# EasyEDA Pro project Project.eprj

# Schematic Schematic1
Create Date: 2025-10-31; Page Name: P1; Project Name: Project; Schematic Name: Schematic1; Update Date: 2026-08-16; Company: 嘉立创EDA; Page Size: A4; Version: V1.0
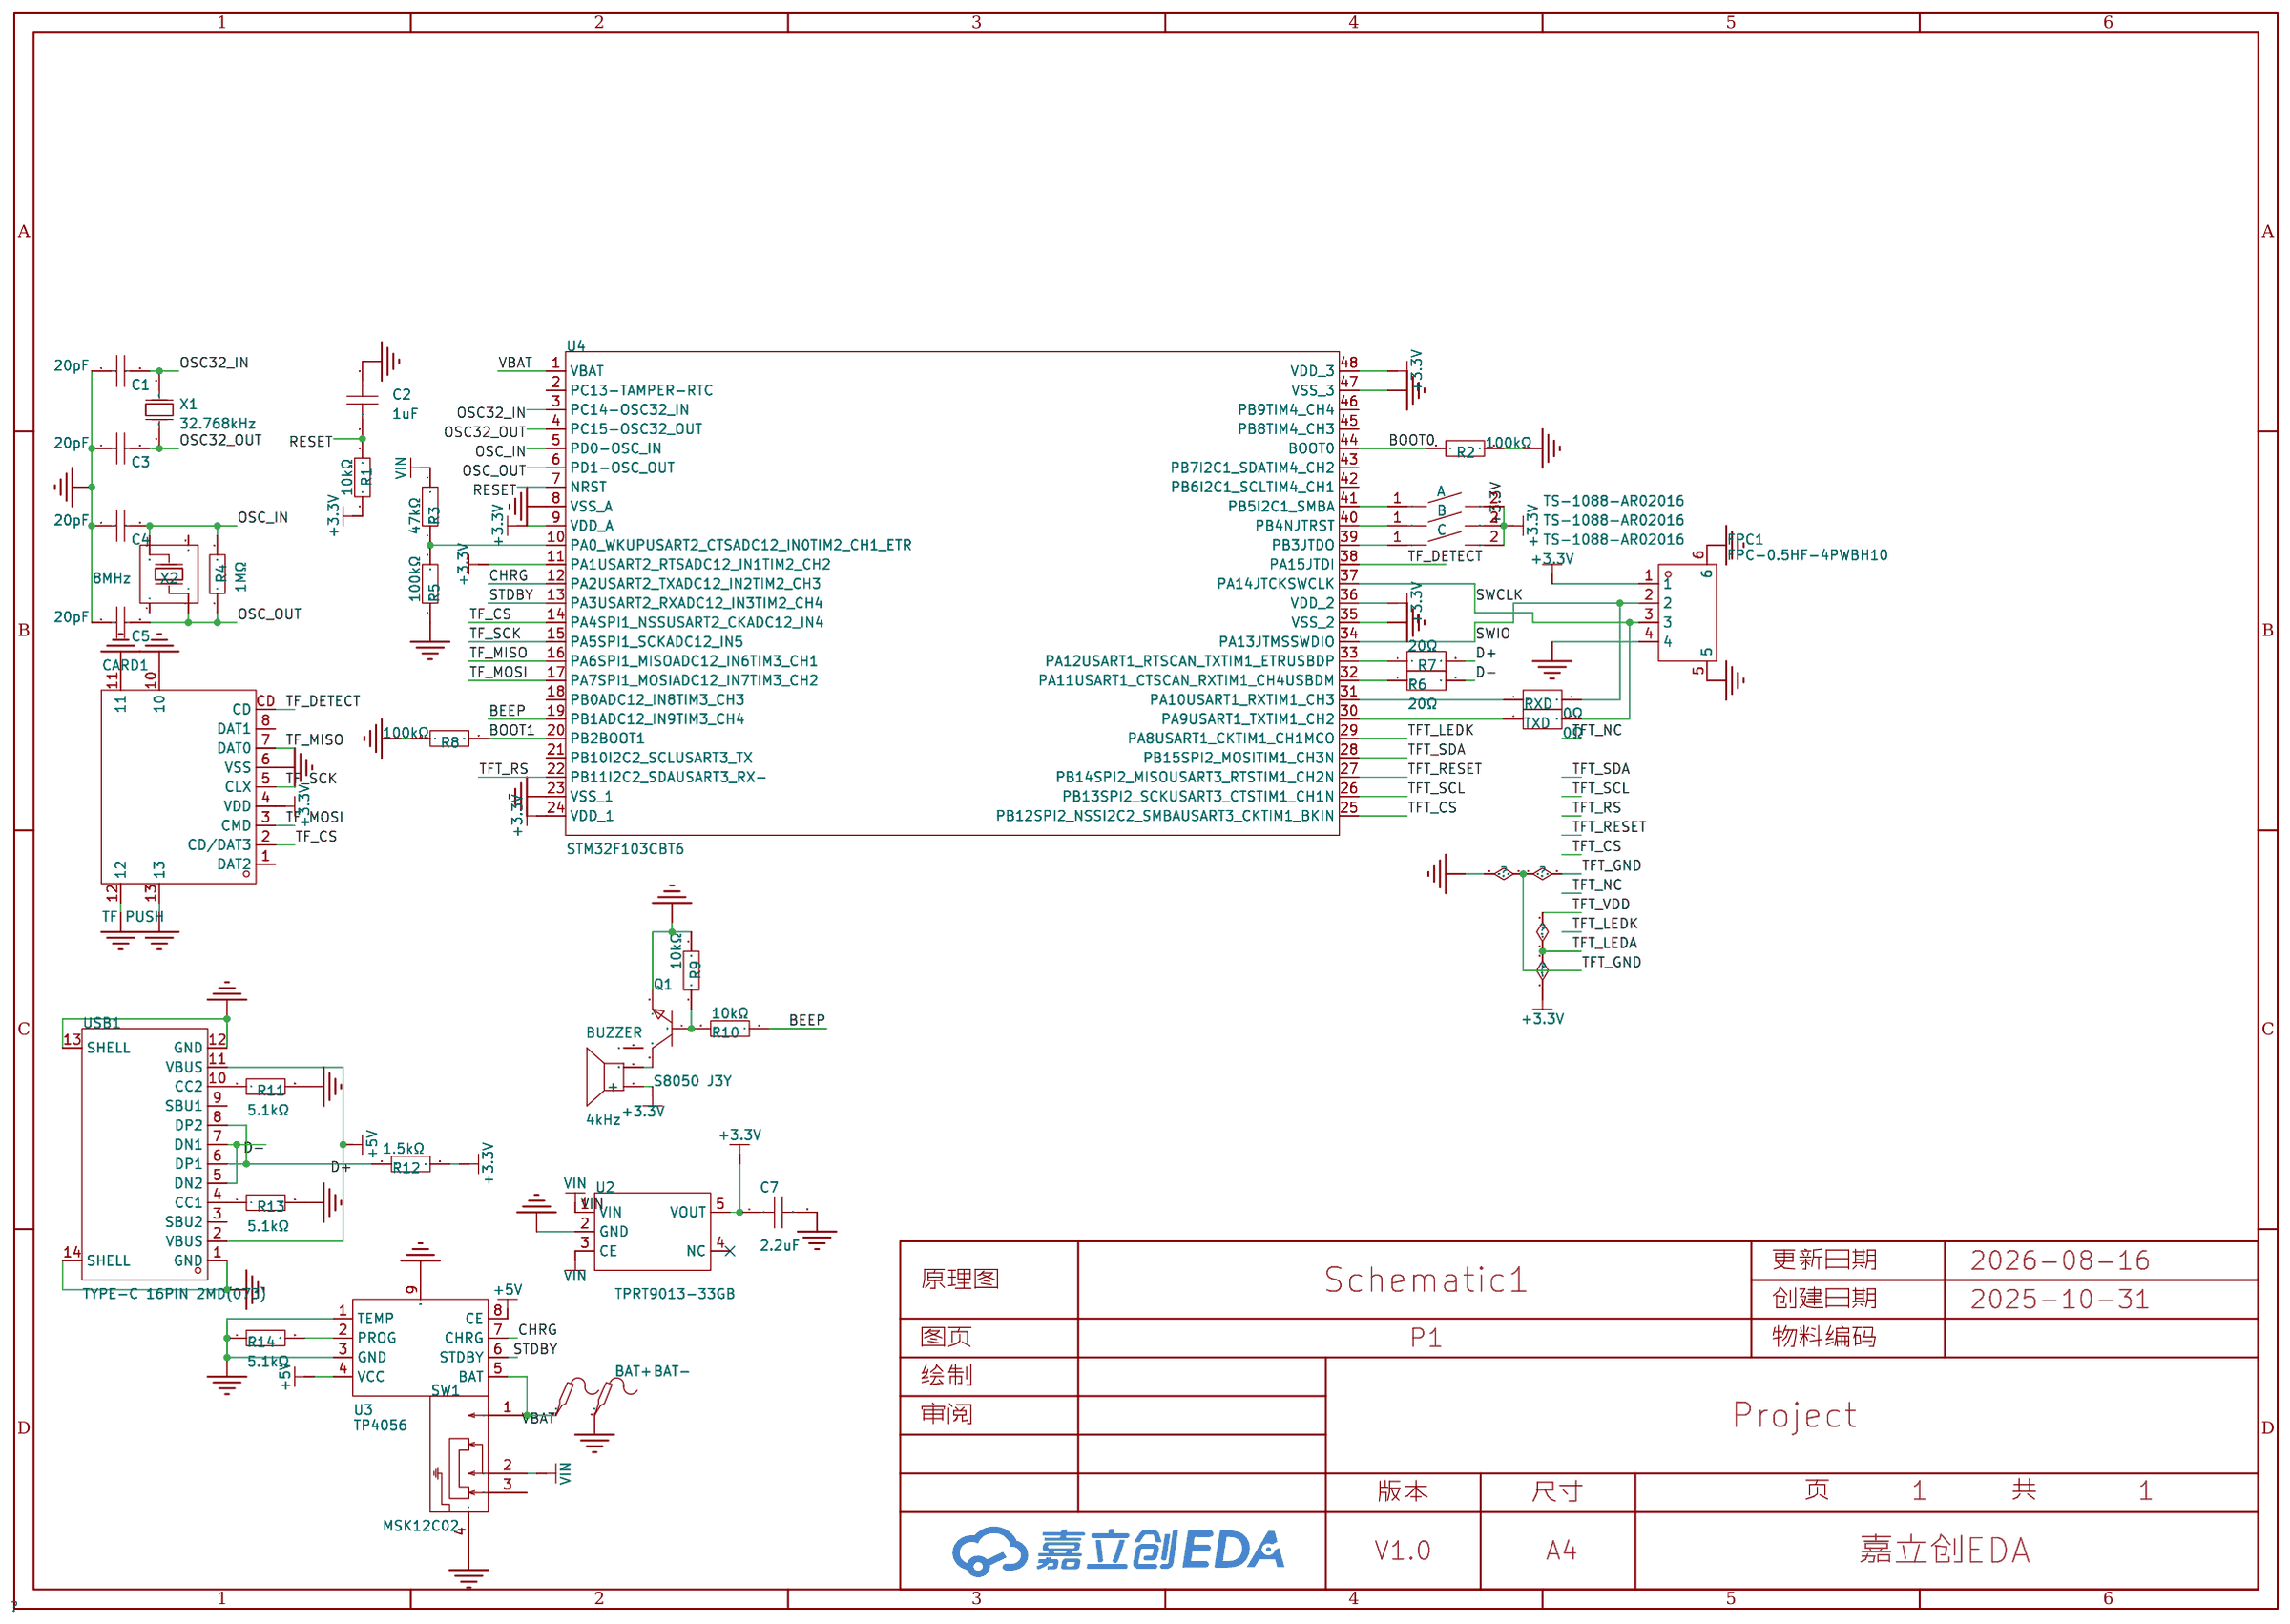
[diagram p0: schematic sheet]

## Parts
A  TS-1088-AR02016  [SW-SMD_L3.9-W3.0-P4.45]
B  TS-1088-AR02016  [SW-SMD_L3.9-W3.0-P4.45]
BAT+  -  [Test-Point-0.5mm]
BAT-  -  [Test-Point-0.5mm]
BUZZER  4kHz  [BUZ-SMD_FST-5020]
C  TS-1088-AR02016  [SW-SMD_L3.9-W3.0-P4.45]
C1  20pF  [C0603]
C2  1uF  [C0603]
C3  20pF  [C0603]
C4  20pF  [C0603]
C5  20pF  [C0603]
C7  2.2uF  [C0603]
CARD1  TF PUSH  [TF-SMD_TF-PUSH]
FPC1  FPC-0.5HF-4PWBH10  [FPC-SMD_4P-P0.50_FPC-0.5HF-4PWBH10]
Q1  S8050 J3Y  [SOT-23-3_L3.0-W1.7-P0.95-LS2.9-BR]
R1  10kΩ  [R0603]
R2  100kΩ  [R0603]
R3  47kΩ  [R0603]
R4  1MΩ  [R0603]
R5  100kΩ  [R0603]
R6  20Ω  [R0603]
R7  20Ω  [R0603]
R8  100kΩ  [R0603]
R9  10kΩ  [R0603]
R10  10kΩ  [R0603]
R11  5.1kΩ  [R0603]
R12  1.5kΩ  [R0603]
R13  5.1kΩ  [R0603]
R14  5.1kΩ  [R0603]
RXD  0Ω  [R0201]
SW1  MSK12C02  [SW-TH_MSK12C02]
TXD  0Ω  [R0201]
U2  TPRT9013-33GB  [SOT-23-5_L3.0-W1.7-P0.95-LS2.8-BL]
U3  TP4056  [ESOP-8_L4.9-W3.9-P1.27-LS6.0-BL-EP-4]
U4  STM32F103CBT6  [LQFP-48_L7.0-W7.0-P0.50-LS9.0-BL]
USB1  TYPE-C 16PIN 2MD(073)  [USB-C-SMD_TYPE-C-6PIN-2MD-073]
X1  32.768kHz  [CRYSTAL-SMD_L3.2-W1.5-1]
X2  8MHz  [CRYSTAL-SMD_4P-L3.2-W2.5-BL]

## Library data of the parts
A B C = TS-1088-AR02016: 电路结构:单刀单掷;按钮形状:圆形按钮;作用力:1.6N;安装方式:立贴;开关长度:4mm;开关宽度:3mm;开关高度:2mm;带支架:不带支架;触点电流:50mA;额定电压:12V;工作寿命:10万次;; LCSC Part Name: 4*3*2mm 立贴 轻触开关; Supplier Part: C720477; Manufacturer: XUNPU(讯普); Supplier Footprint: SMD; JLCPCB Part Class: 基础库; Datasheet: https://item.szlcsc.com/datasheet/TS-1088-AR02016/763484.html; Supplier: LCSC; Circuit: 单刀单掷; Actuator Style: 圆形按钮; Operating Force: 1.6N; Mounting Type: 立贴; Length: 4mm; Width: 3mm; Switch Height: 2mm; with Bracket: 不带支架; Contact Current: 50mA; Voltage Rating: 12V; Actuator/Cap Color: 黑色; Termination Style: SMD接片; Life: 10万次; Operating Temperature: -30℃~+80℃
BAT+ BAT- = Test-Point: Test Point 测试点
BUZZER = FUET-5020: 驱动方式:无源(外部驱动);构造类型:电磁式;频率:4kHz;声压(SPL):75dB;; LCSC Part Name: 电压 3V 频率 4KHZ; Supplier Part: C391029; Manufacturer: FUET(福声科技); Supplier Footprint: SMD,5x5mm; JLCPCB Part Class: 扩展库; Datasheet: https://item.szlcsc.com/datasheet/FUET-5020/367491.html; Supplier: LCSC; Driver Circuitry: 无源(外部驱动); Technology: 电磁式; Voltage - Supply: 2V~4V; Sound Pressure Level(SPL): 75dB; Length: 5mm; Width: 5mm; Height: 2.2mm
C1 C3-C5 = CL10C200JB8NNNC: 容值:20pF;精度:±5%;额定电压:50V;温度系数:C0G;; LCSC Part Name: 20pF ±5% 50V; Supplier Part: C1648; Manufacturer: SAMSUNG(三星); Supplier Footprint: 0603; JLCPCB Part Class: 基础库; Datasheet: https://item.szlcsc.com/datasheet/CL10C200JB8NNNC/2000.html; Supplier: LCSC; Tolerance: ±5%; Voltage Rating: 50V; Temperature Coefficient: C0G
C2 = CL10A105KB8NNNC: 容值:1uF;精度:±10%;额定电压:50V;温度系数:X5R;; LCSC Part Name: 1uF ±10% 50V; Supplier Part: C15849; Manufacturer: SAMSUNG(三星); Supplier Footprint: 0603; JLCPCB Part Class: 基础库; Datasheet: https://item.szlcsc.com/datasheet/CL10A105KB8NNNC/16531.html; Supplier: LCSC; Tolerance: ±10%; Voltage Rating: 50V; Temperature Coefficient: X5R
C7 = HGC0603R5225K500NTHJ: 容值:2.2uF;精度:±10%;额定电压:50V;温度系数:X5R;; LCSC Part Name: 2.2uF ±10% 50V; Supplier Part: C7432769; Manufacturer: Chinocera(华瓷); Supplier Footprint: 0603; JLCPCB Part Class: 扩展库; Datasheet: https://item.szlcsc.com/datasheet/HGC0603R5225K500NTHJ/8438251.html; Supplier: LCSC; Tolerance: ±10%; Voltage Rating: 50V; Temperature Coefficient: X5R
CARD1 = TF PUSH: 卡连接方式:自弹式;卡类型:MicroSD卡(TF卡);连接器类型:卡座;本体最大高度:2mm;工作温度:-25℃~+90℃;; LCSC Part Name: 自弹式 MicroSD卡(TF卡) 卡座; Supplier Part: C393941; Manufacturer: SHOU HAN(首韩); Supplier Footprint: SMD; JLCPCB Part Class: 扩展库; Datasheet: https://item.szlcsc.com/datasheet/TF%2520PUSH/372553.html; Supplier: LCSC; Card Connection Mode: 自弹式; Card Type: MicroSD卡(TF卡); Connector Type: 卡座; Additional Card Detection Pins: 无; Height Above Board: 2mm; Operating Temperature: -25℃~+90℃
FPC1 = FPC-0.5HF-4PWBH10: 锁定特性:翻盖式;触点类型:双侧触点/上下接;触点数量:4P;间距:0.5mm;安装方式:卧贴;工作温度:-25℃~+85℃;; LCSC Part Name: 翻盖式 双侧触点/上下接 P数:4P 间距:0.5mm; Supplier Part: C5343272; Manufacturer: XUNPU(讯普); Supplier Footprint: SMD,P=0.5mm,卧贴; JLCPCB Part Class: 扩展库; Datasheet: https://item.szlcsc.com/datasheet/FPC-0.5HF-4PWBH10/6119918.html; Supplier: LCSC; Locking Feature: 翻盖式; Contact Type: 双侧触点/上下接; Number of Contacts: 4P; Pitch: 0.5mm; Mounting Type: 卧贴; FFC, FCB Thickness: 0.3mm; Height Above Board: 1mm; Contact Material: 铜合金; Contact Plating: 锡; Operating Temperature: -25℃~+85℃; Rated Voltage (Max): 50V; Current Rating (Max): 500mA
Q1 = S8050 J3Y_C2146: 晶体管类型:NPN;集电极电流(Ic):500mA;集射极击穿电压(Vceo):25V;功率(Pd):300mW;直流电流增益(hFE@Ic,Vce):200@50mA,1V;; LCSC Part Name: S8050 J3Y(RANGE:200-350) H档(200-350); Supplier Part: C2146; Manufacturer: CJ(江苏长电/长晶); Supplier Footprint: SOT-23; JLCPCB Part Class: 基础库; Datasheet: https://atta.szlcsc.com/upload/public/pdf/source/20140809/1457707209234.pdf; Supplier: LCSC; Transistor Type: NPN; Collector Current (Ic): 500mA; Collector-Emitter Breakdown Voltage (Vceo): 25V; Power Dissipation (Pd): 300mW; DC Current Gain (hFE@Ic,Vce): 200@50mA,1V; Transition Frequency (fT): 150MHz; Collector Cut-Off Current (Icbo): 100nA; Collector-Emitter Saturation Voltage (VCE(sat)@Ic,Ib): 600mV@500mA,50mA
R1 R9 R10 = 0603WAF1002T5E: 电阻类型:厚膜电阻;阻值:10kΩ;精度:±1%;功率:100mW;工作电压:75V;温度系数:±100ppm/℃;; LCSC Part Name: 厚膜电阻 10kΩ ±1% 100mW; Supplier Part: C25804; Manufacturer: UNI-ROYAL(厚声); Supplier Footprint: 0603; JLCPCB Part Class: 基础库; Datasheet: https://item.szlcsc.com/datasheet/0603WAF1002T5E/26547.html; Supplier: LCSC; Type: 厚膜电阻; Tolerance: ±1%; Power(Watts): 100mW; Voltage-Supply(Max): 75V; Temperature Coefficient: ±100ppm/℃; Operating Temperature: -55℃~+155℃
R2 R5 R8 = 0603WAF1003T5E: 电阻类型:厚膜电阻;阻值:100kΩ;精度:±1%;功率:100mW;工作电压:75V;温度系数:±100ppm/℃;; LCSC Part Name: 100kΩ ±1% 100mW 厚膜电阻; Supplier Part: C25803; Manufacturer: UNI-ROYAL(厚声); Supplier Footprint: 0603; JLCPCB Part Class: 基础库; Datasheet: https://item.szlcsc.com/datasheet/0603WAF1003T5E/26546.html; Supplier: LCSC; Type: 厚膜电阻; Tolerance: ±1%; Power(Watts): 100mW; Voltage-Supply(Max): 75V; Temperature Coefficient: ±100ppm/℃; Operating Temperature: -55℃~+155℃
R3 = 0603WAF4702T5E: 电阻类型:厚膜电阻;阻值:47kΩ;精度:±1%;功率:100mW;工作电压:75V;温度系数:±100ppm/℃;; LCSC Part Name: 47kΩ ±1% 100mW 厚膜电阻; Supplier Part: C25819; Manufacturer: UNI-ROYAL(厚声); Supplier Footprint: 0603; JLCPCB Part Class: 基础库; Datasheet: https://item.szlcsc.com/datasheet/0603WAF4702T5E/26562.html; Supplier: LCSC; Type: 厚膜电阻; Tolerance: ±1%; Power(Watts): 100mW; Voltage-Supply(Max): 75V; Temperature Coefficient: ±100ppm/℃; Operating Temperature: -55℃~+155℃
R4 = 0603WAF1004T5E: 电阻类型:厚膜电阻;阻值:1MΩ;精度:±1%;功率:100mW;最大工作电压:75V;温度系数:±100ppm/℃;; LCSC Part Name: 1MΩ ±1% 100mW 厚膜电阻; Supplier Part: C22935; Manufacturer: UNI-ROYAL(厚声); Supplier Footprint: 0603; JLCPCB Part Class: 基础库; Datasheet: https://atta.szlcsc.com/upload/public/pdf/source/20200306/C422600_1E6D84923E4A46A82E41ADD87F860B5C.pdf; Supplier: LCSC; Type: 厚膜电阻; Tolerance: ±1%; Power(Watts): 100mW; Overload Voltage (Max): 75V; Temperature Coefficient: ±100ppm/℃; Operating Temperature Range: -55℃~+155℃
R6 R7 = FRC0603F20R0TS: 电阻类型:厚膜电阻;阻值:20Ω;精度:±1%;功率:100mW;工作电压:75V;温度系数:±100ppm/℃;; LCSC Part Name: 20Ω ±1% 100mW 厚膜电阻; Supplier Part: C2907012; Manufacturer: FOJAN(富捷); Supplier Footprint: 0603; JLCPCB Part Class: 扩展库; Supplier: LCSC; Type: 厚膜电阻; Tolerance: ±1%; Power(Watts): 100mW; Voltage-Supply(Max): 75V; Temperature Coefficient: ±100ppm/℃; Operating Temperature: -55℃~+155℃
R11 R13 R14 = 0603WAF5101T5E: 电阻类型:厚膜电阻;阻值:5.1kΩ;精度:±1%;功率:100mW;工作电压:75V;温度系数:±100ppm/℃;; LCSC Part Name: 5.1kΩ ±1% 100mW 厚膜电阻; Supplier Part: C23186; Manufacturer: UNI-ROYAL(厚声); Supplier Footprint: 0603; JLCPCB Part Class: 基础库; Datasheet: https://item.szlcsc.com/datasheet/0603WAF5101T5E/23913.html; Supplier: LCSC; Type: 厚膜电阻; Tolerance: ±1%; Power(Watts): 100mW; Voltage-Supply(Max): 75V; Temperature Coefficient: ±100ppm/℃; Operating Temperature: -55℃~+155℃
R12 = 0603WAF1501T5E: 电阻类型:厚膜电阻;阻值:1.5kΩ;精度:±1%;功率:100mW;工作电压:75V;温度系数:±100ppm/℃;; LCSC Part Name: 1.5kΩ ±1% 100mW 厚膜电阻; Supplier Part: C22843; Manufacturer: UNI-ROYAL(厚声); Supplier Footprint: 0603; JLCPCB Part Class: 基础库; Datasheet: https://item.szlcsc.com/datasheet/0603WAF1501T5E/23570.html; Supplier: LCSC; Type: 厚膜电阻; Tolerance: ±1%; Power(Watts): 100mW; Voltage-Supply(Max): 75V; Temperature Coefficient: ±100ppm/℃; Operating Temperature: -55℃~+155℃
RXD TXD = 0201WMF0000TEE: 电阻类型:厚膜电阻;阻值:0Ω;精度:±1%;功率:50mW;工作电压:25V;温度系数:-;; LCSC Part Name: 0Ω ±1% 50mW 厚膜电阻; Supplier Part: C473473; Manufacturer: UNI-ROYAL(厚声); Supplier Footprint: 0201; JLCPCB Part Class: 扩展库; Datasheet: https://item.szlcsc.com/datasheet/0201WMF0000TEE/479866.html; Supplier: LCSC; Type: 厚膜电阻; Tolerance: ±1%; Power(Watts): 50mW; Voltage-Supply(Max): 25V; Operating Temperature: -55℃~+155℃
SW1 = MSK12C02: 电路结构:单刀双掷;安装方式:卧贴;开关颜色:-;额定电流:50mA;额定电压:12V;工作寿命:1万次;; LCSC Part Name: 两档侧拨贴片 7脚 滑动开关; Supplier Part: C431540; Manufacturer: SHOU HAN(首韩); Supplier Footprint: SMD,8x2.8mm; JLCPCB Part Class: 扩展库; Datasheet: https://item.szlcsc.com/datasheet/MSK12C02/427897.html; Supplier: LCSC; Circuit: 单刀双掷; Termination Style: SMD接片; Length: 8mm; Width: 2.8mm; Switch Height: 1.4mm; Mounting Type: 卧贴; Current Rating: 50mA; Voltage Rating: 12V; Life: 1万次; Operating Temperature: -20℃~+70℃
U2 = TPRT9013-33GB: 输出类型:固定;工作电压:7V;输出电压:3.3V;输出电流:500mA;电源纹波抑制比(PSRR):70dB@(1kHz);输出极性:正极;; Supplier Part: C587158; Manufacturer: TECH PUBLIC(台舟); Supplier Footprint: SOT-23-5; JLCPCB Part Class: 扩展库; Datasheet: https://atta.szlcsc.com/upload/public/pdf/source/20210810/692D4D0C3CF190F9330EFD28C3E572CB.pdf; Supplier: LCSC; Output Type: 固定; Voltage - Supply: 7V; Output Voltage: 3.3V; Output Current: 500mA; Power Supply Rejection Ratio (PSRR): 70dB@(1kHz); Operating Temperature: -40℃~+85℃@(Ta); Output Configuration: 正极; Number of Outputs: 1
U3 = TP4056_C20199357: 工作电压:-300mV~8V;最大充电电流:1A;电池类型:锂离子/聚合物;电池节数:1;; LCSC Part Name: 线性锂电池充电芯片; Supplier Part: C20199357; Manufacturer: YONGYUTAI(永裕泰); Supplier Footprint: ESOP-8; JLCPCB Part Class: 扩展库; Datasheet: https://item.szlcsc.com/datasheet/TP4056/21524593.html; Supplier: LCSC; The Chip Type: 充电芯片; Voltage - Supply: -300mV~8V; Charge Current - Max: 1A; Charging Saturation Voltage: 4.2V; Type of Battery: 锂离子/聚合物; Number of Cells: 1; Operating Temperature: -40℃~+85℃; Battery Temperature Detection: 支持; Supply Current (Iq): 100uA
U4 = STM32F103CBT6: CPU内核:ARM Cortex-M3;CPU最大主频:72MHz;CPU位数:32 Bit;; LCSC Part Name: 主流增强型ARM Cortex-M3 MCU，具有128 KB Flash、72 MHz CPU、电机控制、USB和CAN; Supplier Part: C8304; Manufacturer: ST(意法半导体); Supplier Footprint: LQFP-48(7x7); JLCPCB Part Class: 扩展库; Datasheet: https://item.szlcsc.com/datasheet/STM32F103CBT6/8796.html; Supplier: LCSC; CPU Core: ARM Cortex-M3; CPU Maximum Speed: 72MHz; Core Size: 32 Bit; Program Storage Size: 128KB; Program Memory Type: FLASH; RAM Size: 20KB; Number of I/O: 37; ADC (Bit): 12bit; Oscillator Type: 内置; Voltage - Supply: 2V~3.6V; Operating Temperature: -40℃~+85℃
USB1 = TYPE-C 16PIN 2MD(073): 连接器类型:Type-C;协议标准:USB 3.1;公母:母;安装方式:卧贴;触点数量:16P;端口数量:1;额定电流 - 电源:3A;工作温度:-25℃~+85℃;; LCSC Part Name: Type-C 母 卧贴; Supplier Part: C2765186; Manufacturer: SHOU HAN(首韩); Supplier Footprint: SMD; JLCPCB Part Class: 扩展库; Datasheet: https://atta.szlcsc.com/upload/public/pdf/source/20250506/FFB74EDFDFA0AC372CE4A8E4F739CCEF.pdf; Supplier: LCSC; Connector Type: Type-C; Protocol Standard: USB 3.1; Gender: 母; Mounting Type: 卧贴; Number of Contacts: 16P; Number of Ports: 1; Current Rating-Power: 3A; Voltage Rating: 5V; Connect-Disconnect Life: 5千次; Detection color: 黑色; Operating Temperature: -25℃~+85℃
X1 = XKXGI-SUA-32.768K: 晶振类型:贴片晶振;频率:32.768kHz;常温频差:±20ppm;负载电容:12.5pF;频率稳定度:±30ppm;; LCSC Part Name: YST310S 32.768KHZ 2P 3215 12.5PF ±20PPM -40~85℃; Supplier Part: C5213671; Manufacturer: YXC(扬兴晶振); Supplier Footprint: SMD3215-2P; JLCPCB Part Class: 扩展库; Datasheet: https://item.szlcsc.com/datasheet/XKXGI-SUA-32.768K/5908943.html; Supplier: LCSC; Type: 贴片晶振; Normal temperature Frequency Tolerance: ±20ppm; Load Capacitance: 12.5pF; Frequency Stability: ±30ppm; Operating Temperature: -40℃~+85℃
X2 = TAXM8M4RDBCCT2T: 晶振类型:贴片晶振;频率:8MHz;常温频差:±10ppm;负载电容:10pF;频率稳定度:±15ppm;; LCSC Part Name: 8MHz ±10ppm 10pF; Supplier Part: C400090; Manufacturer: YJX(雅晶鑫); Supplier Footprint: SMD3225-4P; JLCPCB Part Class: 扩展库; Datasheet: https://item.szlcsc.com/datasheet/TAXM8M4RDBCCT2T/383475.html; Supplier: LCSC; Type: 贴片晶振; Normal temperature Frequency Tolerance: ±10ppm; Load Capacitance: 10pF; Frequency Stability: ±15ppm; Equivalent Series Resistance(ESR): 250Ω; Operating Temperature: -40℃~+85℃

## Nets
+3.3V: A.2 B.2 BUZZER.1(+) C.2 C7.1 CARD1.4(VDD) FPC1.1 R1.1 R12.2 U2.5(VOUT) U4.9(VDD_A) U4.11(PA1USART2_RTSADC12_IN1TIM2_CH2) U4.24(VDD_1) U4.36(VDD_2) U4.48(VDD_3)
+5V: U3.4(VCC) U3.8(CE) USB1.2(VBUS) USB1.11(VBUS)
GND: BAT-.1 C1.1 C2.2 C3.1 C4.1 C5.1 C7.2 CARD1.6(VSS) CARD1.10 CARD1.11 CARD1.12 CARD1.13 FPC1.4 FPC1.5 FPC1.6 Q1.2(E) R2.2 R5.1 R8.1 R9.2 R11.2 R13.2 R14.1 SW1.4 U2.2(GND) U3.1(TEMP) U3.3(GND) U3.9(PAD) U4.8(VSS_A) U4.23(VSS_1) U4.35(VSS_2) U4.47(VSS_3) USB1.1(GND) USB1.12(GND) USB1.13(SHELL) USB1.14(SHELL)
VBAT: BAT+.1 SW1.1 U3.5(BAT) U4.1(VBAT)
VIN: R3.2 SW1.2 U2.1(VIN) U2.3(CE)
BEEP: R10.1 U4.19(PB1ADC12_IN9TIM3_CH4)
BOOT0: R2.1 U4.44(BOOT0)
BOOT1: R8.2 U4.20(PB2BOOT1)
CHRG: U3.7(CHRG) U4.12(PA2USART2_TXADC12_IN2TIM2_CH3)
D+: R7.2 R12.1 USB1.6(DP1) USB1.8(DP2)
D-: R6.2 USB1.5(DN2) USB1.7(DN1)
OSC32_IN: C1.2 U4.3(PC14-OSC32_IN) X1.2(OSC2)
OSC32_OUT: C3.2 U4.4(PC15-OSC32_OUT) X1.1(OSC1)
OSC_IN: C4.2 R4.2 U4.5(PD0-OSC_IN) X2.3
OSC_OUT: C5.2 R4.1 U4.6(PD1-OSC_OUT) X2.1
RESET: C2.1 R1.2 U4.7(NRST)
STDBY: U3.6(STDBY) U4.13(PA3USART2_RXADC12_IN3TIM2_CH4)
SWCLK: FPC1.3 TXD.2 U4.37(PA14JTCKSWCLK)
SWIO: FPC1.2 RXD.2 U4.34(PA13JTMSSWDIO)
TF_CS: CARD1.2(CD/DAT3) U4.14(PA4SPI1_NSSUSART2_CKADC12_IN4)
TF_DETECT: CARD1.CD U4.38(PA15JTDI)
TF_MISO: CARD1.7(DAT0) U4.16(PA6SPI1_MISOADC12_IN6TIM3_CH1)
TF_MOSI: CARD1.3(CMD) U4.17(PA7SPI1_MOSIADC12_IN7TIM3_CH2)
TF_SCK: CARD1.5(CLX) U4.15(PA5SPI1_SCKADC12_IN5)
TFT_CS: U4.25(PB12SPI2_NSSI2C2_SMBAUSART3_CKTIM1_BKIN)
TFT_LEDK: U4.29(PA8USART1_CKTIM1_CH1MCO)
TFT_RESET: U4.27(PB14SPI2_MISOUSART3_RTSTIM1_CH2N)
TFT_RS: U4.22(PB11I2C2_SDAUSART3_RX-)
TFT_SCL: U4.26(PB13SPI2_SCKUSART3_CTSTIM1_CH1N)
TFT_SDA: U4.28(PB15SPI2_MOSITIM1_CH3N)
$1N4001: R6.1 U4.32(PA11USART1_CTSCAN_RXTIM1_CH4USBDM)
$1N4003: R7.1 U4.33(PA12USART1_RTSCAN_TXTIM1_ETRUSBDP)
$1N4077: B.1 U4.40(PB4NJTRST)
$1N4610: Q1.1(B) R9.1 R10.2
$1N4932: BUZZER.2 Q1.3(C)
$1N5544: R14.2 U3.2(PROG)
$1N12139: A.1 U4.41(PB5I2C1_SMBA)
$1N18546: R3.1 R5.2 U4.10(PA0_WKUPUSART2_CTSADC12_IN0TIM2_CH1_ETR)
$1N29071: R13.1 USB1.4(CC1)
$1N29073: R11.1 USB1.10(CC2)
$1N30783: TXD.1 U4.30(PA9USART1_TXTIM1_CH2)
$1N30829: RXD.1 U4.31(PA10USART1_RXTIM1_CH3)
$1N32801: C.1 U4.39(PB3JTDO)

Not connected (* = marked no-connect by the designer): BUZZER 3; CARD1 1(DAT2) 8(DAT1); SW1 3; U2 4(NC)*; U4 2(PC13-TAMPER-RTC) 18(PB0ADC12_IN8TIM3_CH3) 21(PB10I2C2_SCLUSART3_TX) 42(PB6I2C1_SCLTIM4_CH1) 43(PB7I2C1_SDATIM4_CH2) 45(PB8TIM4_CH3) 46(PB9TIM4_CH4); USB1 3(SBU2) 9(SBU1); X2 2 4

# Board PCB1
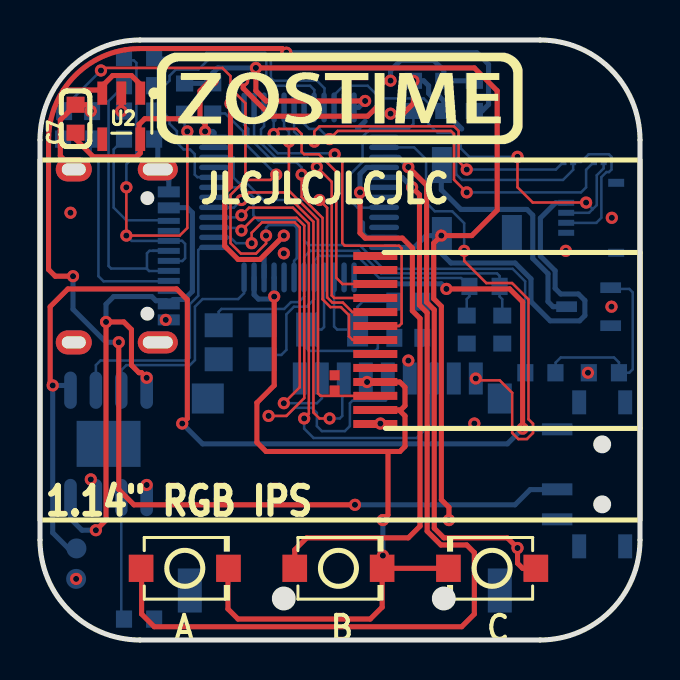
[diagram p1: board, top side]
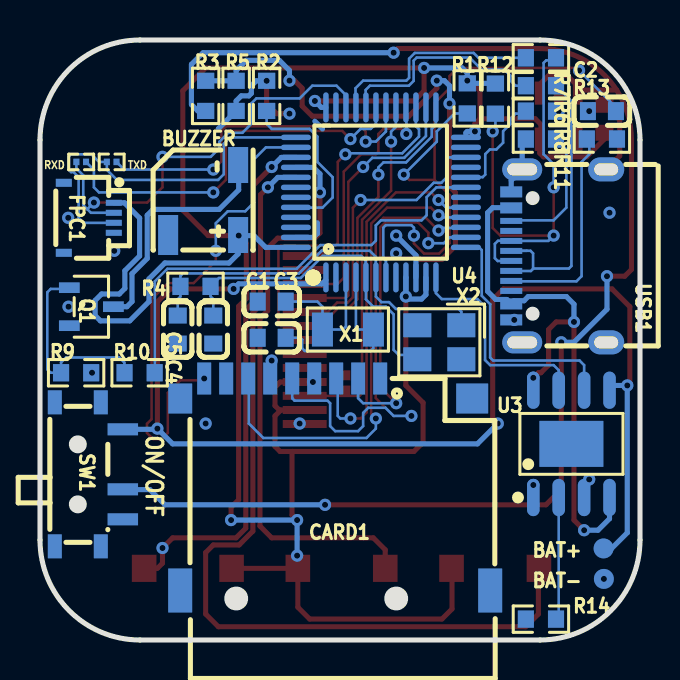
[diagram p2: board, bottom side, seen from below]

Outline 30 x 30 mm; copper layers: Top Layer, Bottom Layer. Coordinates in mm from the lower left corner of the outline.
Outline path: 0,25 0,5 arc(1.46,1.46) 5,0 25,0 arc(28.54,1.46) 30,5 30,25 arc(28.54,28.54) 25,30 5,30 arc(1.46,28.54) 0,25
Stack: Top Layer 0.035mm / Dielectric1 1.51mm FR4 er 4.5 / Bottom Layer 0.035mm

## Design rules (mm)
template: JLCPCB Capability(Two Layers Board)
spacing copperThickness1oz (default): track to track 0.102, other pairs 0.152 to 0.3
spacing copperThickness2oz: track to track 0.203, other pairs 0.152 to 0.3
track width copperThickness1oz (default): min 0.127, default 0.254, max 2.54
track width copperThickness2oz: min 0.203, default 0.254, max 2.54
differential pair differentialPair (default): width min 0.127, default 0.254, max 2.54; gap min 0.152, default 0.152
via viaSize (default): diameter min 0.5, default 0.61, max 10; hole min 0.3, default 0.305, max 6.3

## Placement (name value [footprint] x y rotation side)
A  TS-1088-AR02016  [SW-SMD_L3.9-W3.0-P4.45]  7.24 3.58 0 top
B  TS-1088-AR02016  [SW-SMD_L3.9-W3.0-P4.45]  14.92 3.58 0 top
BAT+  -  [test-point-0.5mm]  1.82 4.58 180 bottom
BAT-  -  [test-point-0.5mm]  1.81 3.06 180 bottom
BUZZER  4kHz  [BUZ-SMD_FST-5020]  21.84 22 90 bottom
C  TS-1088-AR02016  [SW-SMD_L3.9-W3.0-P4.45]  22.61 3.58 180 top
C1  20pF  [C0603]  18.42 16.92 180 bottom
C2  1uF  [C0603]  1.91 26.44 0 bottom
C3  20pF  [C0603]  18.42 15.11 180 bottom
C4  20pF  [C0603]  21.34 15.52 90 bottom
C5  20pF  [C0603]  23.11 15.52 90 bottom
C7  2.2uF  [C0603]  1.78 26.06 90 top
CARD1  TF PUSH  [TF-SMD_TF-PUSH]  15.24 7.78 180 bottom
FPC1  FPC-0.5HF-4PWBH10  [FPC-SMD_4P-P0.50_FPC-0.5HF-4PWBH10]  27.56 21.11 270 bottom
NOREF  -  [Pad_e47]  16.76 11.5 0 top
NOREF#2  -  [Pad_e33]  16.76 17.1 0 top
NOREF#3  -  [Pad_e37]  16.76 16.4 0 top
NOREF#4  -  [Pad_e36]  16.76 15.7 0 top
NOREF#5  -  [Pad_e35]  16.76 15 0 top
NOREF#6  -  [Pad_e1257]  14.73 13.24 0 top
NOREF#7  -  [Pad_e1256]  14.73 12.47 0 top
NOREF#8  -  [Pad_e34]  16.76 14.3 0 top
NOREF#9  -  [Pad_e29]  16.76 19.2 0 top
NOREF#10  -  [Pad_e31]  16.76 18.5 0 top
NOREF#11  -  [Pad_e44]  16.76 13.6 0 top
NOREF#12  -  [Pad_e32]  16.76 17.8 0 top
NOREF#13  -  [Pad_e48]  16.76 10.8 0 top
NOREF#14  -  [Pad_e46]  16.76 12.21 0 top
NOREF#15  -  [Pad_e45]  16.76 12.9 0 top
Q1  S8050 J3Y  [SOT-23-3_L3.0-W1.7-P0.95-LS2.9-BR]  27.43 16.67 0 bottom
R1  10kΩ  [R0603]  8.64 27.08 270 bottom
R2  100kΩ  [R0603]  18.67 27.21 90 bottom
R3  47kΩ  [R0603]  21.72 27.21 270 bottom
R4  1MΩ  [R0603]  22.22 17.68 180 bottom
R5  100kΩ  [R0603]  20.19 27.21 90 bottom
R6  20Ω  [R0603]  4.95 27.71 180 bottom
R7  20Ω  [R0603]  4.95 29.11 180 bottom
R8  100kΩ  [R0603]  4.95 26.44 0 bottom
R9  10kΩ  [R0603]  28.19 13.36 180 bottom
R10  10kΩ  [R0603]  25.02 13.36 0 bottom
R11  5.1kΩ  [R0603]  4.95 25.05 0 bottom
R12  1.5kΩ  [R0603]  7.23 27.07 90 bottom
R13  5.1kΩ  [R0603]  1.91 25.05 180 bottom
R14  5.1kΩ  [R0603]  4.95 1.04 180 bottom
RXD  0Ω  [R0201]  27.94 23.9 0 bottom
SW1  MSK12C02  [SW-TH_MSK12C02]  27.56 8.28 270 bottom
TXD  0Ω  [R0201]  26.42 23.9 0 bottom
U2  TPRT9013-33GB  [SOT-23-5_L3.0-W1.7-P0.95-LS2.8-BL]  4.06 26.19 180 top
U3  TP4056  [ESOP-8_L4.9-W3.9-P1.27-LS6.0-BL-EP-4]  3.43 9.81 180 bottom
U4  STM32F103CBT6  [LQFP-48_L7.0-W7.0-P0.50-LS9.0-BL]  12.95 22.38 180 bottom
USB1  TYPE-C 16PIN 2MD(073)  [USB-C-SMD_TYPE-C-6PIN-2MD-073]  4.06 19.2 90 bottom
X1  32.768kHz  [CRYSTAL-SMD_L3.2-W1.5-1]  14.61 15.52 0 bottom
X2  8MHz  [CRYSTAL-SMD_4P-L3.2-W2.5-BL]  10.03 14.89 0 bottom

## Footprints (pads in the part's own frame, mm; a bottom-side part is the same pattern mirrored in y, then rotated)
BUZ-SMD_FST-5020
  rect 1.8x1 smd: 1(-1.75,-1.75) 2(1.75,-1.75)
  rect 2x1 smd: 3(-1.75,1.75)
C0603
  rect 0.8x0.9 smd: 1(-0.7,0) 2(0.7,0)
CRYSTAL-SMD_4P-L3.2-W2.5-BL
  rect 1.4x1.2 smd: 1(-1.1,-0.85) 2(1.1,-0.85) 3(1.1,0.85) 4(-1.1,0.85)
CRYSTAL-SMD_L3.2-W1.5-1
  rect 1.05x1.7 smd: 1(-1.275,0) 2(1.275,0)
ESOP-8_L4.9-W3.9-P1.27-LS6.0-BL-EP-4
  oval 0.63x1.865 smd: 1(-1.905,-2.683) 2(-0.635,-2.683) 3(0.635,-2.683) 4(1.905,-2.683) 5(1.905,2.683) 6(0.635,2.683) 7(-0.635,2.683) 8(-1.905,2.683)
  rect 3.2x2.3 smd: 9(0,0)
FPC-SMD_4P-P0.50_FPC-0.5HF-4PWBH10
  rect 0.3x0.8 smd: 1(-0.75,1.25) 2(-0.25,1.25) 3(0.25,1.25) 4(0.75,1.25)
  rect 0.4x0.8 smd: 5(1.75,-1.25) 6(-1.75,-1.25)
LQFP-48_L7.0-W7.0-P0.50-LS9.0-BL
  oval 0.27x1.5 smd: 1(-2.75,-4.25) 2(-2.25,-4.25) 3(-1.75,-4.25) 4(-1.25,-4.25) 5(-0.75,-4.25) 6(-0.25,-4.25) 7(0.25,-4.25) 8(0.75,-4.25) 9(1.25,-4.25) 10(1.75,-4.25) 11(2.25,-4.25) 12(2.75,-4.25) 25(2.75,4.25) 26(2.25,4.25) 27(1.75,4.25) 28(1.25,4.25) 29(0.75,4.25) 30(0.25,4.25) 31(-0.25,4.25) 32(-0.75,4.25) 33(-1.25,4.25) 34(-1.75,4.25) 35(-2.25,4.25) 36(-2.75,4.25)
  oval 1.5x0.27 smd: 13(4.25,-2.75) 14(4.25,-2.25) 15(4.25,-1.75) 16(4.25,-1.25) 17(4.25,-0.75) 18(4.25,-0.25) 19(4.25,0.25) 20(4.25,0.75) 21(4.25,1.25) 22(4.25,1.75) 23(4.25,2.25) 24(4.25,2.75) 37(-4.25,2.75) 38(-4.25,2.25) 39(-4.25,1.75) 40(-4.25,1.25) 41(-4.25,0.75) 42(-4.25,0.25) 43(-4.25,-0.25) 44(-4.25,-0.75) 45(-4.25,-1.25) 46(-4.25,-1.75) 47(-4.25,-2.25) 48(-4.25,-2.75)
Pad_e29
  rect 2.2x0.4 smd: 1(0,0)
Pad_e31
  rect 2.2x0.4 smd: 2(0,0)
Pad_e32
  rect 2.2x0.4 smd: 3(0,0)
Pad_e33
  rect 2.2x0.4 smd: 4(0,0)
Pad_e34
  rect 2.2x0.4 smd: 8(0,0)
Pad_e35
  rect 2.2x0.4 smd: 7(0,0)
Pad_e36
  rect 2.2x0.4 smd: 6(0,0)
Pad_e37
  rect 2.2x0.4 smd: 5(0,0)
Pad_e44
  rect 2.2x0.4 smd: 9(0,0)
Pad_e45
  rect 2.2x0.4 smd: 10(0,0)
Pad_e46
  rect 2.2x0.4 smd: 11(0,0)
Pad_e47
  rect 2.2x0.4 smd: 12(0,0)
Pad_e48
  rect 2.2x0.4 smd: 13(0,0)
Pad_e1256
  rect 0.5x0.5 smd: 49(0,0)
Pad_e1257
  rect 0.5x0.5 smd: 50(0,0)
R0201
  rect 0.303x0.324 smd: 1(-0.241,0) 2(0.241,0)
R0603
  rect 0.806x0.864 smd: 1(-0.753,0) 2(0.753,0)
SOT-23-3_L3.0-W1.7-P0.95-LS2.9-BR
  rect 1.038x0.532 smd: 1(1.101,-0.95) 2(1.101,0.95) 3(-1.101,0)
SOT-23-5_L3.0-W1.7-P0.95-LS2.8-BL
  rect 0.49x1.157 smd: 1(-0.95,-1.153) 2(0,-1.153) 3(0.95,-1.153)
  rect 0.49x1.175 smd: 4(0.95,1.153) 5(-0.95,1.153)
SW-SMD_L3.9-W3.0-P4.45
  rect 1.23x1.36 smd: 1(-2.185,0) 2(2.185,0)
SW-TH_MSK12C02
  rect 0.6x1.524 smd: 1(-2.25,1.7) 2(0.75,1.7) 3(2.25,1.7)
  rect 1.2x0.7 smd: 4(-3.6,-1.7) 4(-3.6,0.6) 4(3.6,-1.7) 4(3.6,0.6)
test-point-0.5mm
  round 1 smd: 1(0,0)
TF-SMD_TF-PUSH
  rect 0.7x1.6 smd: 1(2.25,5.3) 2(1.15,5.3) 3(0.05,5.3) 4(-1.05,5.3) 5(-2.15,5.3) 6(-3.25,5.3) 7(-4.35,5.3) 8(-5.45,5.3) CD(-6.55,5.3)
  rect 1.2x1.5 smd: 10(-7.75,4.3)
  rect 1.2x2.2 smd: 11(-7.75,-5.3) 12(7.75,-5.3)
  rect 1.6x1.5 smd: 13(6.85,4.3)
USB-C-SMD_TYPE-C-6PIN-2MD-073
  rect 0.55x1.1 smd: 1(-3.2,2.375) 2(-2.4,2.375) 11(2.4,2.375) 12(3.2,2.375)
  rect 0.3x1.1 smd: 3(-1.75,2.375) 4(-1.25,2.375) 5(-0.75,2.375) 6(-0.25,2.375) 7(0.25,2.375) 8(0.75,2.375) 9(1.25,2.375) 10(1.75,2.375)
  oval 1.2x1.8 hole 0.6x1.2: 13(-4.325,-2.375) 14(4.325,-2.375)
  oval 1.1x2 hole 0.6x1.5: 13(-4.325,1.825) 14(4.325,1.825)

## Nets
As in the schematic, except:
+3.3V: A.2 B.2 BUZZER.1 C.2 C7.1 CARD1.4 FPC1.1 NOREF.12 NOREF#15.10 R1.1 R12.2 U2.5 U4.9 U4.11 U4.24 U4.36 U4.48
GND: BAT-.1 C1.1 C2.2 C3.1 C4.1 C5.1 C7.2 CARD1.6 CARD1.10 CARD1.11 CARD1.12 CARD1.13 FPC1.4 FPC1.5 FPC1.6 NOREF#6.50 NOREF#8.8 NOREF#13.13 Q1.2 R2.2 R5.1 R8.1 R9.2 R11.2 R13.2 R14.1 SW1.4 U2.2 U3.1 U3.3 U3.9 U4.8 U4.23 U4.35 U4.47 USB1.1 USB1.12 USB1.13 USB1.14
TFT_CS: NOREF#5.7 U4.25
TFT_LEDK: NOREF#7.49 NOREF#14.11 U4.29
TFT_RESET: NOREF#4.6 U4.27
TFT_RS: NOREF#3.5 U4.22
TFT_SCL: NOREF#2.4 U4.26
TFT_SDA: NOREF#12.3 U4.28

Pads without a net: BUZZER 3; CARD1 1 8; NOREF#9 1; NOREF#10 2; NOREF#11 9; SW1 3; U2 4; U4 2 18 21 42 43 45 46; USB1 3 9; X2 2 4

## Via types
v1: diameter 0.61, hole 0.305, Top Layer to Bottom Layer, 74 vias

## Routing (per net, layer and track width the routed paths; a pad name or vN(x,y) marks a point on that pad's centre or on a via; arc(x,y) is an arc through that point)
+3.3V: length 130.9
  Top Layer w0.254: 8,26.06 8,27.46 8.51,27.97 v1(8.64,27.97) ; 8,26.06 5.24,26.06 4.95,25.78 4.95,25.1 U2.5 5.01,24.35 4.83,24.16 2.67,24.16 1.78,25.05 C7.1 ; 8,26.06 8.25,25.81 v1(8.25,25.43) ; v1(17.15,6) 17.4,6.25 17.4,9.43 ; v1(16.26,26.95) 11.3,26.95 10.8,27.46 v1(10.8,28.6) 21.72,28.6 22.86,27.46 22.86,21.49 21.59,20.22 v1(20.07,20.22) 19.69,19.84 19.69,17.07 20.07,16.68 20.07,7.01 20.45,6.63 v1(20.45,6) ; 17.4,9.43 11.3,9.43 10.85,9.88 10.85,11.86 11.71,12.73 v1(11.71,17.17) ; 17.4,9.43 18,9.43 18.25,9.68 18.25,11.2 18,11.46 ; 16.13,11.5 16.17,11.46 17.36,11.5 17.95,11.5 18,11.46 ; 18,11.46 18.25,11.71 18.25,12.64 17.99,12.9 NOREF#15.10 ; A.2 9.4,3.56 9.4,1.55 9.9,1.05 16.51,1.05 17.11,1.64 B.2 C.2
  Bottom Layer w0.254: FPC1.1 25.78,21.86 25.02,21.1 25.02,19.2 25.76,18.46 25.76,17.58 26.03,17.3 26.92,17.3 27.24,16.98 27.24,16.22 26.98,15.96 25.51,15.96 24.55,16.92 24.55,18.06 23.75,18.85 20.55,18.85 20.09,19.3 BUZZER.1 v1(20.07,20.22) 19.3,20.22 18.71,19.63 U4.48 ; U4.11 10.7,17.26 10.92,17.05 11.58,17.05 v1(11.71,17.17) 11.71,18.12 U4.9 ; v1(8.25,25.43) 8.64,25.43 8.7,25.36 U4.24 ; v1(16.26,26.95) 15.93,26.63 U4.36 ; v1(17.15,4.22) v1(17.15,6) v1(20.45,6) ; v1(10.8,28.6) 8.89,28.6 8.64,28.35 v1(8.64,27.97) R1.1 7.24,27.83 7.23,27.82
  vias: v1(16.35,12.9)
+5V: length 29.2
  Top Layer w0.254: v1(2.79,5.49) 3.3,6 v1(3.3,15.9) 4.19,15.9 4.57,15.52 4.57,13.74 4.95,13.36 5.08,13.36 v1(5.33,13.11)
  Bottom Layer w0.254: v1(5.33,13.11) U3.8 ; U3.4 1.52,6.06 2.1,5.49 v1(2.79,5.49) ; 6.31,21.61 6.33,21.62 7.37,21.62 7.62,21.36 7.62,17.44 7.21,17.03 6.66,17.03 USB1.2 6.44,16.83 6.31,16.96 5.8,16.96 5.59,17.17 3.68,17.17 3.3,16.79 v1(3.3,15.9)
GND: length 17.2
  Top Layer w0.254: 18.67,27.84 18.67,26.83 18.16,26.32 v1(17.53,26.32) ; v1(4.06,26.44) U2.2 ; USB1.14 1.02,24.2 1.02,26 C7.2 2.35,26.76 2.54,26.57 v1(2.54,26.44)
  Bottom Layer w0.254: R11.2 5.89,24.86 USB1.14 6.44,22.98 USB1.12 ; 21.08,25.56 21.08,25.56 R5.1 20.19,26.95 19.94,27.21 19.56,27.21 19.43,27.33 19.43,27.71 19.19,27.96 v1(18.67,27.96) ; U4.47 16.33,20.13 16.13,20.33 16.13,20.86 ; 16.26,25.94 15.88,25.56
  vias: v1(1.52,21.36) v1(1.81,3.06) v1(2.54,8.03) v1(5.33,7.75) v1(6.29,16.01) v1(12.19,19.33) v1(17.02,10.82) v1(18.42,13.97) v1(21.72,10.82) v1(26.29,19.46) v1(27.4,13.36) v1(28.59,21.11) v1(28.58,16.67)
VBAT: length 62.3
  Top Layer w0.254: v1(7.11,10.82) 7.37,11.08 7.37,17.02 6.83,17.55 1.4,17.55 0.51,16.67 0.51,12.86 v1(0.64,12.73) ; v1(20.32,17.55) 23.48,17.55 24.13,16.91 v1(24.13,10.57)
  Bottom Layer w0.254: v1(20.32,17.55) 20.07,17.81 15.9,17.81 15.7,18 ; U3.5 1.29,12.73 v1(0.64,12.73) 0.64,5.36 1.42,4.58 BAT+.1 ; SW1.1 24.17,10.53 v1(24.13,10.57) 23.37,9.81 8.13,9.81 v1(7.11,10.82)
VIN: length 75.3
  Top Layer w0.254: 1.17,27.5 2.96,27.5 U2.3 3.11,27.7 3.63,28.22 4.57,28.22 5.01,27.78 U2.1 ; 1.17,27.5 arc(0.62,26.3) 0.43,25 0.43,18.52 0.76,18.19 v1(1.65,18.19) ; 1.17,27.5 arc(2.51,28.84) 4.28,29.52 arc(4.64,29.56) 5,29.57 12.11,29.57 v1(12.32,29.37) ; v1(15.75,6.76) 4.7,6.76 3.94,7.52 v1(3.94,14.89)
  Bottom Layer w0.254: v1(3.94,14.89) 3.3,14.89 1.65,16.54 v1(1.65,18.19) ; v1(12.32,29.37) 21.84,29.37 22.43,28.78 22.43,26.77 22.11,26.45 R3.2 ; v1(15.75,6.76) 23.75,6.76 24.51,7.52 25.85,7.52 SW1.2
BEEP: length 23
  Bottom Layer w0.127: U4.19 10.18,22.63 10.67,22.14 10.67,21.24 10.92,20.98 12.95,20.98 13.21,20.73 13.21,19.97 13.43,19.75 15.98,19.75 17.16,18.56 23.63,18.56 24.26,17.94 24.26,13.37 R10.1
BOOT0: length 8.9
  Bottom Layer w0.127: U4.44 17.19,21.62 15.88,21.62 15.37,22.13 15.37,23.14 16.13,23.9 16.13,25.17 16.52,25.56 18.42,25.56 18.67,25.81 R2.1
BOOT1: length 5.5
  Bottom Layer w0.127: 5.58,26.32 6.22,26.32 6.48,26.06 6.48,25.81 6.84,25.44 6.84,24.86 7.18,24.53 7.51,24.53 7.74,24.29 7.74,23.27 7.87,23.14 8.56,23.14 8.58,23.13 U4.20
CHRG: length 11.1
  Bottom Layer w0.127: U3.7 4.06,13.49 4.32,13.74 7.49,13.74 7.75,14 7.75,16.67 8.13,17.05 9.91,17.05 10.2,17.34 U4.12
D+: length 23.7
  Top Layer w0.127: v1(7.37,25.43) 7.37,20.6 6.99,20.22 v1(4.32,20.22) v1(4.32,22.63)
  Bottom Layer w0.127: v1(7.37,25.43) 7.23,25.56 R12.1 ; 6.19,19.96 7.1,19.96 7.26,19.81 7.26,19.09 7.12,18.95 6.2,18.95 ; 4.07,28.98 4.69,28.98 4.82,28.86 4.82,24.29 4.32,23.79 v1(4.32,22.63) ; v1(4.32,20.22) 4.58,19.95 6.31,19.95
D-: length 14.6
  Bottom Layer w0.127: 5.35,18.56 5.46,18.45 6.32,18.45 6.31,18.45 ; 5.35,18.56 5.35,19.34 5.47,19.46 5.65,19.46 ; 5.35,18.56 5.33,18.57 3.56,18.57 3.43,18.7 3.43,26.94 4.07,27.59 ; 6.32,19.45 6.33,19.45 ; 6.32,19.45 6.31,19.45 6.31,19.46 5.65,19.46 6.31,19.46 6.32,19.45
OSC32_IN: length 6.7
  Bottom Layer w0.127: C1.2 16.13,16.92 15.88,16.67 15.88,15.53 X1.2 14.86,15.52 14.7,15.68 14.7,18
OSC32_OUT: length 9.2
  Bottom Layer w0.127: C3.2 16.99,15.11 16.89,15.01 16.89,14.58 16.76,14.46 13.46,14.46 13.34,14.58 13.34,15.52 X1.1 14.08,15.52 14.2,15.65 14.2,18
OSC_IN: length 16.7
  Bottom Layer w0.127: C4.2 21.34,17.05 21.47,17.18 R4.2 21.05,18.1 16.96,18.1 15.86,19.2 13.95,19.2 13.72,18.98 13.72,18.02 13.7,18 13.7,17.03 13.34,16.67 12.7,16.67 12.32,16.28 12.32,14.51 12.06,14.25 11.17,14.25 11.13,14.29
OSC_OUT: length 19.5
  Bottom Layer w0.127: 13.21,18.13 13.21,18.01 13.2,18 13.2,17.17 12.93,16.89 12.55,16.89 12.21,16.55 9.08,16.55 8.93,16.41 8.93,15.99 ; 13.21,18.13 U4.6 ; 13.21,18.13 13.21,19.16 13.51,19.46 15.92,19.46 15.92,19.46 17.05,18.33 22.85,18.33 22.98,18.2 R4.1 22.98,17.17 23.11,17.04 C5.2
RESET: length 32.2
  Top Layer w0.127: v1(11.81,23.27) 11.68,23.14 11.67,23.14 11.53,23 10.27,23 ; v1(11.3,20.22) 11.3,19.83 10.8,19.32 10.05,19.32 9.53,19.84 9.53,22.26 10.27,23 ; v1(3.05,28.48) 3.18,28.6 9.12,28.6 9.53,28.2 9.53,27.59 10.27,26.84 10.27,23
  Bottom Layer w0.127: v1(11.3,20.22) 11.3,20.62 11.43,20.74 12.71,20.74 12.84,20.62 12.84,19.09 12.7,18.95 12.7,18 ; v1(11.81,23.27) 10.16,24.92 10.16,25.43 9.26,26.33 R1.2 ; 1.49,26.32 1.49,26.92 v1(3.05,28.48)
STDBY: length 12.5
  Bottom Layer w0.127: U4.13 8.05,19.63 7.91,19.5 7.91,17.21 7.49,16.79 7.49,14.12 7.34,13.97 3.02,13.97 2.79,13.74 U3.6
SWCLK: length 19.2
  Bottom Layer w0.127: U4.37 20.49,25.13 20.81,24.81 20.81,23.29 21.09,23 26.15,23 26.66,23.51 TXD.2 27.05,23.9 27.43,24.29 28.45,24.29 28.58,24.16 28.58,23.52 28.45,23.4 28.32,23.4 28.07,23.14 28.07,21.11 27.81,20.86 26.31,20.86 FPC1.3
SWIO: length 22
  Top Layer w0.127: v1(27.31,21.87) 24.64,21.87 23.88,22.63 v1(23.88,24.16)
  Bottom Layer w0.127: v1(23.88,24.16) 21.46,24.16 21.04,24.58 21.04,24.91 20.59,25.36 19.88,25.36 19.43,25.81 19.43,26.83 19.18,27.08 17.02,27.08 16.38,27.71 15.17,27.71 14.7,27.25 U4.34 ; v1(27.31,21.87) 27.63,21.55 27.63,21.53 ; 27.63,21.53 27.45,21.36 FPC1.2 ; 27.63,21.53 27.84,21.75 27.84,23.24 28.18,23.58 RXD.2
TF_CS: length 17.4
  Top Layer w0.127: v1(12.19,11.84) 12.98,12.63 12.98,20.63 12.73,20.88 11.1,20.88 10.58,20.36 v1(10.58,19.84)
  Bottom Layer w0.127: CARD1.2 14.1,13.07 14.1,12.09 13.84,11.84 v1(12.19,11.84) ; v1(10.58,19.84) 9.81,19.84 9.52,20.13 U4.14
TF_DETECT: length 24.8
  Top Layer w0.127: v1(21.21,19.46) 21.21,18.95 22.31,17.85 23.6,17.85 24.42,17.03 24.42,11.04 24.65,10.81 24.65,10.35 24.35,10.05 23.91,10.05 23.61,10.35 23.61,12.36 22.99,12.98 21.84,12.98
  Bottom Layer w0.127: v1(21.21,19.46) 21.21,20.84 20.61,21.44 19.74,21.44 19.3,21.87 19.3,24.03 18.71,24.63 U4.38
  vias: v1(21.79,13.08)
TF_MISO: length 24.7
  Top Layer w0.127: v1(10.07,21.24) 10.45,21.62 12.64,21.62 13.44,20.82 13.44,11.31 v1(13.21,11.08)
  Bottom Layer w0.127: U4.16 9.97,21.13 v1(10.07,21.24) ; v1(13.21,11.08) 13.21,10.57 13.68,10.1 18.83,10.1 19.56,10.82 19.56,13.04 CARD1.7
TF_MOSI: length 18.8
  Top Layer w0.127: v1(10.07,22) 10.45,22.38 12.2,22.38 13.67,20.91 13.67,11.38 13.97,11.08 v1(14.48,11.08)
  Bottom Layer w0.127: v1(14.48,11.08) 14.99,11.08 15.11,11.2 15.11,13 CARD1.3 ; v1(10.07,22) 9.69,21.62 8.9,21.62
TF_SCK: length 25.2
  Top Layer w0.127: v1(11.43,11.2) 12.32,11.2 13.21,12.1 13.21,20.72 12.83,21.11 10.71,21.11 v1(10.07,20.48)
  Bottom Layer w0.127: CARD1.5 17.39,12.08 17.27,11.97 15.62,11.97 15.49,11.84 15.49,10.7 15.24,10.44 14.1,10.44 13.84,10.7 13.84,11.36 13.59,11.61 12.72,11.61 12.32,11.2 v1(11.43,11.2) ; 8.63,20.6 9.95,20.6 v1(10.07,20.48)
TFT_CS: length 15.2
  Top Layer w0.127: 16.13,15 15.64,15 15.45,15.19 15.45,16.24 15.05,16.64 14.52,16.64 14.13,17.04 14.13,21.11 13.08,22.15 v1(13.08,23.27)
  Bottom Layer w0.127: v1(13.08,23.27) 13.08,23.63 12.83,23.88 11.7,23.88 10.41,25.16 10.41,25.56 10.2,25.77 10.2,26.5
TFT_LEDK: length 17.2
  Top Layer w0.127: 16.13,12.21 14.03,12.21 13.9,12.33 13.9,21.01 12.45,22.46 v1(12.45,24.92)
  Bottom Layer w0.127: v1(12.45,24.92) 12.45,25.42 12.2,25.66 12.2,26.5
TFT_RESET: length 19
  Top Layer w0.127: v1(14.73,24.29) 15.11,23.9 15.11,19.84 15.24,19.71 17.95,19.71 18.08,19.59 18.08,15.83 17.95,15.7 17.45,15.7 17.4,15.65 16.18,15.65 16.13,15.7
  Bottom Layer w0.127: 11.16,26.46 11.2,26.5 11.2,25.69 11.05,25.53 11.05,25.17 11.89,24.34 14.68,24.34 v1(14.73,24.29)
TFT_RS: length 13.8
  Top Layer w0.127: v1(13.97,22) 14.36,21.61 14.36,17.13 14.62,16.87 15.14,16.87 15.62,16.4 16.13,16.4
  Bottom Layer w0.127: v1(13.97,22) 11.18,22 10.32,22.86 9.94,22.86 9.68,23.11 9.68,24.13 U4.22
TFT_SCL: length 13.4
  Top Layer w0.127: 16.13,17.1 14.71,17.1 14.58,17.23 14.58,22.91 v1(13.84,23.65)
  Bottom Layer w0.127: 10.7,26.5 10.7,25.2 11.79,24.11 13.39,24.11 v1(13.84,23.65)
TFT_SDA: length 12.6
  Top Layer w0.127: 16.13,17.8 15.12,17.8 14.81,18.11 14.81,23.42 13.94,24.29 13.21,24.29 13.08,24.41 13.08,25.3 12.83,25.56 11.94,25.56 v1(11.68,25.3)
  Bottom Layer w0.127: v1(11.68,25.3) 11.68,26.48 11.7,26.5
$1N4001: length 11
  Bottom Layer w0.127: R6.1 6.22,27.71 6.48,27.97 6.48,28.21 6.79,28.52 7.92,28.52 8.52,29.12 11.16,29.12 11.32,28.97 11.32,27.95 11.56,27.71 13.5,27.71 13.72,27.5 13.72,26.52
$1N4003: length 11
  Bottom Layer w0.127: 14.22,26.52 14.22,27.59 13.84,27.97 11.68,27.97 11.55,28.11 11.55,29.07 11.26,29.35 8.32,29.35 8.08,29.11 5.71,29.11
$1N4077: length 29
  Top Layer w0.254: B.1 12.74,4.51 13.34,5.11 18.42,5.11 19,5.69 19,16.08 18.62,16.46 18.62,19.59 18.12,20.09 16.26,20.09 16,20.35 v1(16,22.38)
  Bottom Layer w0.254: U4.40 16.33,23.63 16,23.31 v1(16,22.38)
$1N4610: length 10.2
  Bottom Layer w0.127: R10.2 25.78,13.37 25.78,13.87 26.03,14.12 28.7,14.12 28.95,13.88 R9.1 29.46,13.36 29.64,13.54 29.64,17.38 29.46,17.55 28.59,17.55 Q1.1
$1N4932: length 11.9
  Bottom Layer w0.254: Q1.3 25.65,16.67 25.4,16.92 25.4,18.32 24.64,19.08 24.64,21.24 24.35,21.53 21.04,21.53 20.07,22.51 20.07,23.65
$1N5544: length 6.1
  Bottom Layer w0.127: U3.2 4.06,1.18 R14.2
$1N12139: length 44.4
  Top Layer w0.254: v1(18.6,22.63) 18.97,22.27 18.97,16.75 19.36,16.36 19.36,5.44 20.05,4.75 21.34,4.75 21.72,4.37 21.72,1.3 21.08,0.66 5.72,0.66 5.08,1.3 5.08,3.56 A.1
  Bottom Layer w0.254: v1(18.6,22.63) 18.11,23.13 U4.41
$1N18546: length 30.3
  Top Layer w0.254: v1(12.19,20.22) 11,19.03 9.91,19.03 9.23,19.7 9.23,22.38 9.53,22.67 v1(9.53,26.83) ; v1(17.53,27.97) 17.27,27.97 16.89,27.59 16.89,26.7 16.38,26.19 11.56,26.19 10.16,27.59 v1(10.16,27.97)
  Bottom Layer w0.254: R3.1 R5.2 20.19,28.48 19.69,28.98 18.03,28.98 17.53,28.48 v1(17.53,27.97) ; v1(12.19,20.22) 11.2,19.23 U4.10 ; v1(10.16,27.97) 9.78,27.97 9.53,27.71 v1(9.53,26.83)
$1N29071: length 10.4
  Bottom Layer w0.127: 6.31,17.95 6.29,17.94 3.18,17.94 2.92,18.19 2.92,23.9 2.53,24.29 2.53,24.92
$1N29073: length 6.4
  Bottom Layer w0.127: 4.07,24.92 3.68,24.53 3.68,21.62 4.32,20.98 6.28,20.98 6.31,20.95
$1N30783: length 17.4
  Top Layer w0.127: v1(13.72,24.92) 13.72,25.43 13.97,25.68 20.7,25.68 20.93,25.45 20.93,23.93 v1(21.34,23.52)
  Bottom Layer w0.127: v1(13.72,24.92) 13.21,24.92 12.7,25.42 U4.30 ; TXD.1 25.79,23.52 v1(21.34,23.52)
$1N30829: length 19.6
  Top Layer w0.127: v1(21.34,22.38) 20.7,23.02 20.7,25.3 20.55,25.45 14.88,25.45 v1(14.48,25.05)
  Bottom Layer w0.127: RXD.1 27.31,23.51 27.31,22.63 27.05,22.38 v1(21.34,22.38) ; U4.31 13.2,25.81 13.46,25.56 13.97,25.56 v1(14.48,25.05)
$1N32801: length 26.4
  Top Layer w0.254: C.1 24.13,3.58 23.88,3.84 v1(23.88,4.6) 23.37,5.11 20.19,5.11 19.71,5.59 19.71,16.51 19.33,16.89 19.33,22.74 v1(18.42,23.65)
  Bottom Layer w0.254: v1(18.42,23.65) 17.94,24.13 U4.39

## Copper pours and planes (outline as drawn; the poured copper is in the pictures)
GND on Top Layer: -0.13,30.13 30.1,30.13 30.1,-0.1 -0.13,-0.1
GND on Bottom Layer: -0.06,30.11 30.16,30.11 30.16,-0.11 -0.06,-0.11

## Text on the board
Bottom Silkscreen Layer: ON/OFF
Top Silkscreen Layer: JLCJLCJLCJLC | 1.14" RGB IPS
